# Altium schematic sheet AUAV-X1_SENSORS_R1.SchDoc
size A4; PageSetup: Record=PageOptions|CenterHorizontal=True|CenterVertical=True|PrintScale=0.97|XCorrection=1.00|YCorrection=1.00|PrintKind=2|BorderSize=5000000|LeftOffset=0|BottomOffset=0|Orientation=2|PaperLength=1000|PaperWidth=1000|Scale=100|PaperSource=267|PrintQuality=-4|MediaType=1|DitherType=1|PaperKind=A4|PrintScaleMode=1
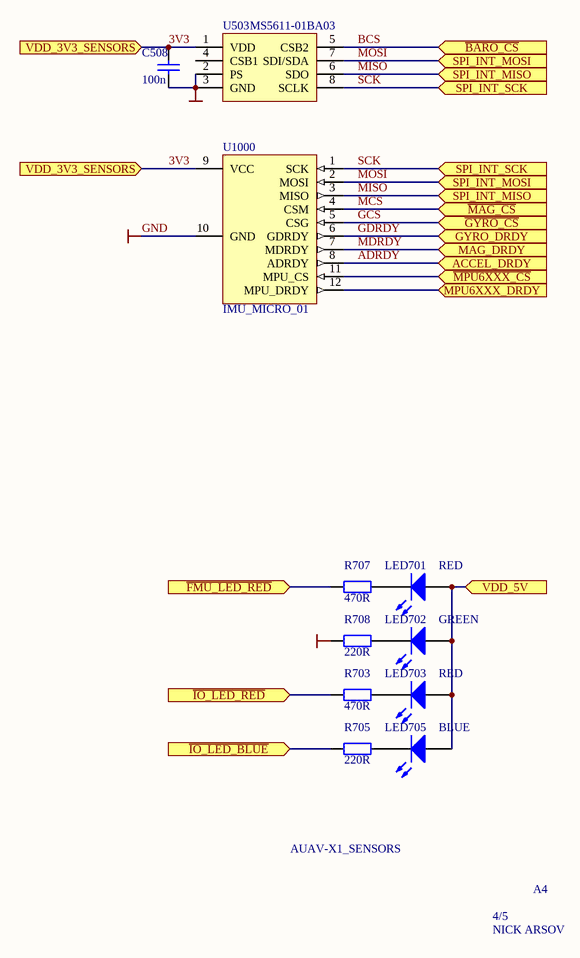
[diagram p0: AUAV-X1_SENSORS_R1.SchDoc]

## Parts
C508  100n  [0402A]
LED701  RED  [0603A]
LED702  GREEN  [0603A]
LED703  RED  [0603A]
LED705  BLUE  [0603A]
R703  470R  [0603A]
R705  220R  [0603A]
R707  470R  [0603A]
R708  220R  [0603A]
U503  MS5611-01BA03  [MS5611]
U1000  IMU_MICRO_01  [MicroIMU_01]

## Ports
ACCEL_DRDY, GYRO_DRDY, MAG_DRDY, MPU6XXX_DRDY, SPI_INT_MISO, SPI_INT_MOSI, SPI_INT_SCK, VDD_3V3_SENSORS, VDD_5V, ~{BARO_CS}, ~{FMU_LED_RED}, ~{GYRO_CS}, ~{IO_LED_BLUE}, ~{IO_LED_RED}, ~{MAG_CS}, ~{MPU6XXX_CS}

## Nets
GND: C508.1 R708.2 U503.2(PS) U503.3(GND) U1000.10(GND)
3V3: C508.2 U503.1(VDD) U1000.9(VCC) ; port VDD_3V3_SENSORS
~{FMU_LED_RED}: R707.2 ; port ~{FMU_LED_RED}
~{IO_LED_BLUE}: R705.2 ; port ~{IO_LED_BLUE}
~{IO_LED_RED}: R703.2 ; port ~{IO_LED_RED}
~{MPU6XXX_CS}: U1000.11(MPU_CS) ; port ~{MPU6XXX_CS}
ADRDY: U1000.8(ADRDY) ; port ACCEL_DRDY
BCS: U503.5(CSB2) ; port ~{BARO_CS}
GCS: U1000.5(CSG) ; port ~{GYRO_CS}
GDRDY: U1000.6(GDRDY) ; port GYRO_DRDY
MCS: U1000.4(CSM) ; port ~{MAG_CS}
MDRDY: U1000.7(MDRDY) ; port MAG_DRDY
MISO: U503.6(SDO) U1000.3(MISO) ; port SPI_INT_MISO
MOSI: U503.7(SDI/SDA) U1000.2(MOSI) ; port SPI_INT_MOSI
MPU6XXX_DRDY: U1000.12(MPU_DRDY) ; port MPU6XXX_DRDY
SCK: U503.8(SCLK) U1000.1(SCK) ; port SPI_INT_SCK
VDD_5V: LED701.1(A) LED702.1(A) LED703.1(A) LED705.1(A) ; port VDD_5V
NetLED701_2: LED701.2(K) R707.1
NetLED702_2: LED702.2(K) R708.1
NetLED703_2: LED703.2(K) R703.1
NetLED705_2: LED705.2(K) R705.1

Not connected (* = marked no-connect by the designer): U503 4(CSB1)

## Notes on the sheet
- AUAV-X1_SENSORS
- 4/5
- A4
- NICK ARSOV

## Library data of the parts
C508 = Cap: Capacitor; Value: 100pF; Published: 8-Jun-2000; LatestRevisionDate: 17-Jul-2002; LatestRevisionNote: Re-released for DXP Platform.; PackageReference: RAD-0.3; Publisher: Altium Limited
LED701-LED703 LED705 = LED0: Typical INFRARED GaAs LED; Published: 8-Jun-2000; LatestRevisionDate: 08-Jul-2005; LatestRevisionNote: Mech Layer 1 removed.; PackageReference: LED-0; Publisher: Altium Limited
R703 R705 R707 R708 = Res2: Resistor; Value: 1K; Published: 8-Jun-2000; LatestRevisionDate: 17-Jul-2002; LatestRevisionNote: Re-released for DXP Platform.; PackageReference: AXIAL-0.4; Publisher: Altium Limited